# Altium project WeatherStation.PrjPcb
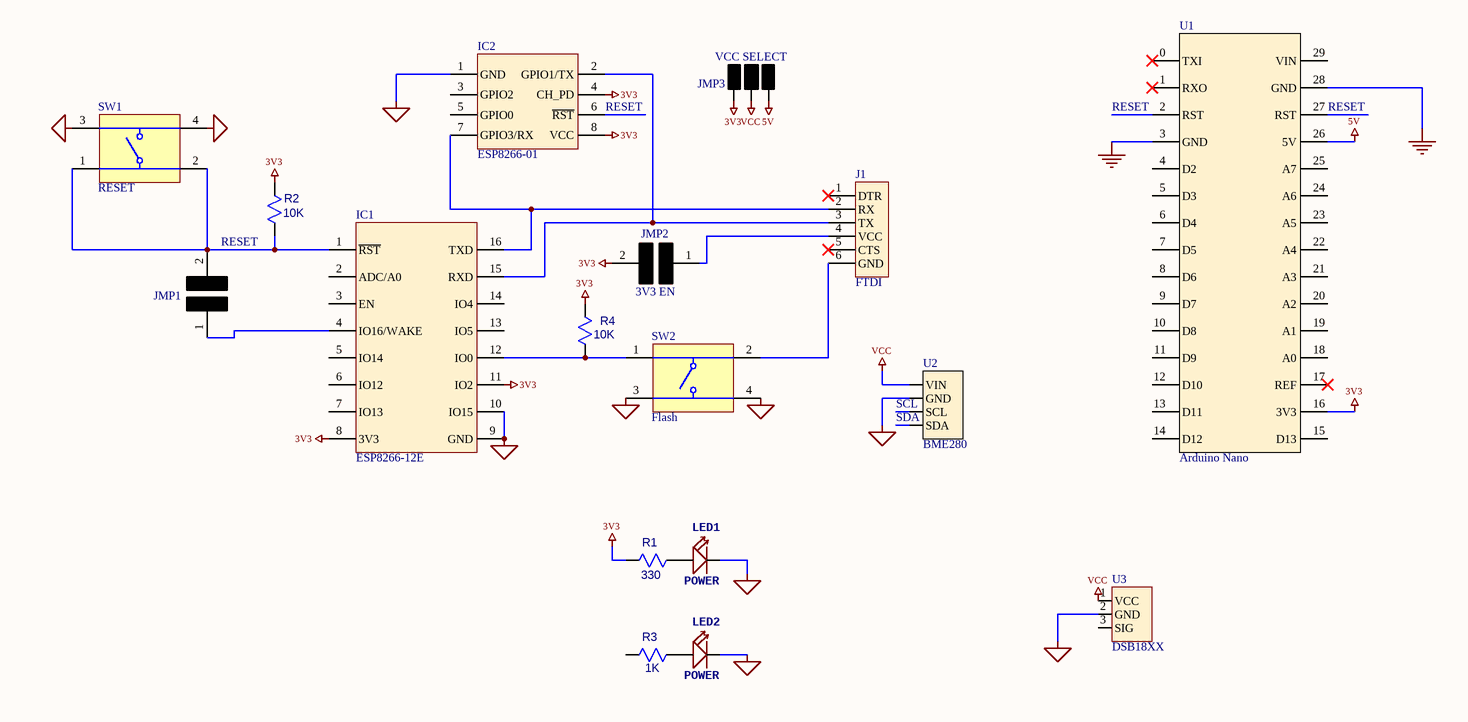
[diagram p0: WeatherStation.SchDoc]
title: Weather Station; author: DMH
1 sheet, 17 parts. Net scope: global (net labels, ports and power ports of the same name join across sheets).
Board file: WeatherStation.PcbDoc

## Sheet WeatherStation.SchDoc: Weather Station
size Tabloid

### Parts
IC1  ESP8266-12E  [ESP8266-12E]
IC2  ESP8266-01  [ESP8266-01]
J1  FTDI  [HEAD_1x6]
JMP1  JUMP  [JUMP]  (value not drawn)
JMP2  3V3 EN  [JUMP]
JMP3  VCC SELECT  [JMP3]
LED1  POWER  [LED-0805]
LED2  POWER  [LED-0805]
R1  value 330  [CAPC0805(2012)75_N]  (hidden comment: RES_0805)
R2  value 10K  [CAPC0805(2012)75_N]  (hidden comment: RES_0805)
R3  value 1K  [CAPC0805(2012)75_N]  (hidden comment: RES_0805)
R4  value 10K  [CAPC0805(2012)75_N]  (hidden comment: RES_0805)
SW1  RESET  [Tactile Switch]
SW2  Flash  [Tactile Switch]
U1  Arduino Nano  [Arduino Nano]
U2  BME280  [BME280]
U3  DSB18XX  [HEAD_1x3]

### Nets
3V3: IC1.8(3V3) IC1.11(IO2) IC2.4(CH_PD) IC2.8(VCC) JMP2.2 JMP3.3 R1.2 R2.1 R4.1 U1.16(3V3)
5V: JMP3.2 U1.26(5V)
GND: IC1.9(GND) IC1.10(IO15) IC2.1(GND) LED1.- LED2.- SW1.3 SW1.4 SW2.3 SW2.4 U1.3(GND) U1.28(GND) U2.2(GND) U3.2(GND)
VCC: JMP3.1 U2.1(VIN) U3.1(VCC)
RESET: IC1.1(~{RST}) IC2.6(~{RST}) JMP1.2 R2.2 SW1.1 SW1.2 U1.2(RST) U1.27(RST)
SCL: U2.3(SCL)
SDA: U2.4(SDA)
NetIC1_4: IC1.4(IO16/WAKE) JMP1.1
NetIC1_12: IC1.12(IO0) R4.2 SW2.1
NetIC1_15: IC1.15(RXD) IC2.2(GPIO1/TX) J1.3(TX)
NetIC1_16: IC1.16(TXD) IC2.7(GPIO3/RX) J1.2(RX)
NetJ1_4: J1.4(VCC) JMP2.1
NetJ1_6: J1.6(GND) SW2.2
NetLED1_+: LED1.+ R1.1
NetLED2_+: LED2.+ R3.1

Not connected (* = marked no-connect by the designer): IC1 2(ADC/A0) 3(EN) 5(IO14) 6(IO12) 7(IO13) 13(IO5) 14(IO4); IC2 3(GPIO2) 5(GPIO0); J1 1(DTR)* 5(CTS)*; R3 2; U1 0(TXI)* 1(RXO)* 4(D2) 5(D3) 6(D4) 7(D5) 8(D6) 9(D7) 10(D8) 11(D9) 12(D10) 13(D11) 14(D12) 15(D13) 17(REF)* 18(A0) 19(A1) 20(A2) 21(A3) 22(A4) 23(A5) 24(A6) 25(A7) 29(VIN); U3 3(SIG)

### Notes on the sheet
- Title
- Size:
- Date:
- Tabloid
- Number:
- Time:
- Revision:
- Sheet
- of
- File:

### Library data of the parts
IC1 = ESP8266: PART: ESP8266-12E
J1 = FTDI_Connector
JMP2 = JUMP
JMP3 = JUMP_3
LED1 LED2 = SMD-LED-CLEAR-YELLOW(0805): MPN: 17-215UYC/S530-A3/TR8
SW1 SW2 = Tact Switch
U3 = DALLAS_TEMP